# EAGLE design SchematicWeatherStationModule (EAGLE 9.6.2)
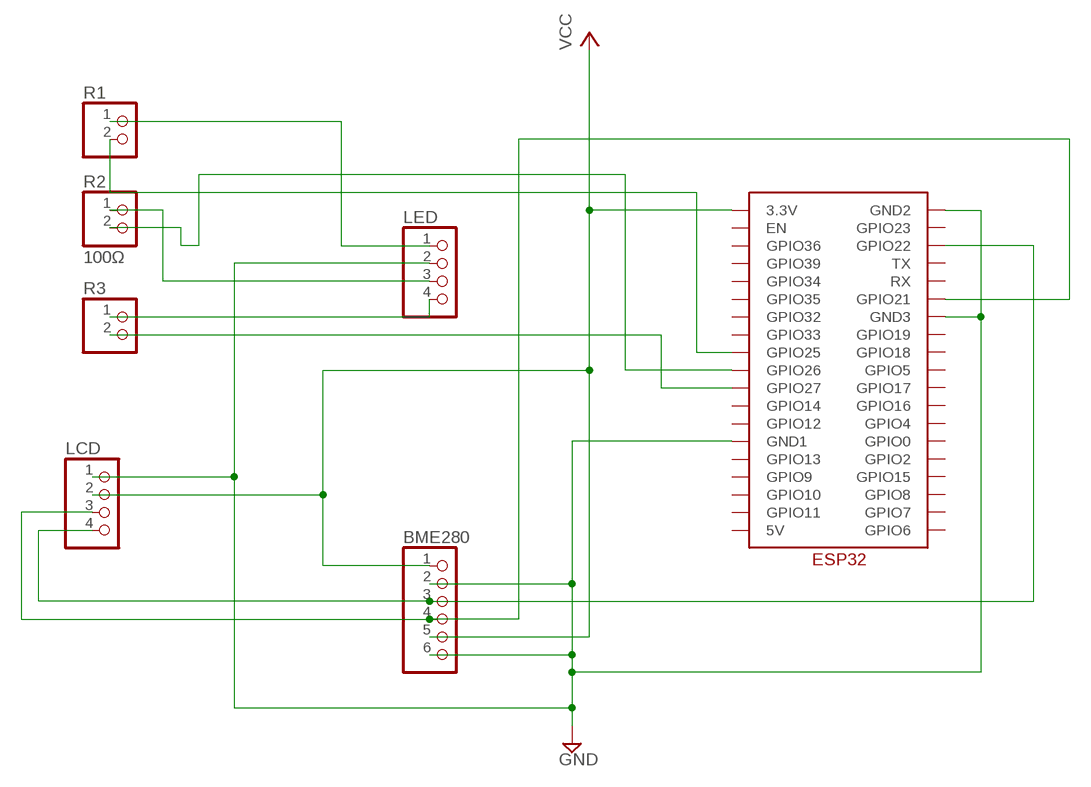
[diagram p0: schematic, sheet 1]

## Parts
BME280  PINHD-1X6/90  [1X06/90]
LCD  PINHD-1X4/90  [1X04/90]
LED  PINHD-1X4  [1X04]
R1  PINHD-1X2  [1X02]
R2  100Ω  PINHD-1X2  [1X02]
R3  PINHD-1X2  [1X02]
U$1  ESP32  [ESP32]

## Nets
GND: BME280.2 BME280.6 LCD.1 LED.2 U$1.GND1 U$1.GND2 U$1.GND3
N$1: LED.1 R1.1
N$2: LED.3 R2.1
N$3: LED.4 R3.1
N$4: R3.2 U$1.GPIO27
N$5: R1.2 U$1.GPIO25
N$6: R2.2 U$1.GPIO26
SCL: BME280.3 LCD.4 U$1.GPIO22
SDA: BME280.4 LCD.3 U$1.GPIO21
VCC: BME280.1 BME280.5 LCD.2 U$1.3.3V
Unconnected: U$1.5V U$1.EN U$1.GPIO0 U$1.GPIO2 U$1.GPIO4 U$1.GPIO5 U$1.GPIO6 U$1.GPIO7 U$1.GPIO8 U$1.GPIO9 U$1.GPIO10 U$1.GPIO11 U$1.GPIO12 U$1.GPIO13 U$1.GPIO14 U$1.GPIO15 U$1.GPIO16 U$1.GPIO17 U$1.GPIO18 U$1.GPIO19 U$1.GPIO23 U$1.GPIO32 U$1.GPIO33 U$1.GPIO34 U$1.GPIO35 U$1.GPIO36 U$1.GPIO39 U$1.RX U$1.TX

## Library data of the parts
BME280 = pinhead:PINHD-1X6: PIN HEADER
LCD LED = pinhead:PINHD-1X4: PIN HEADER
R1-R3 = pinhead:PINHD-1X2: PIN HEADER
U$1 = ESP32 Module:ESP32

## Board
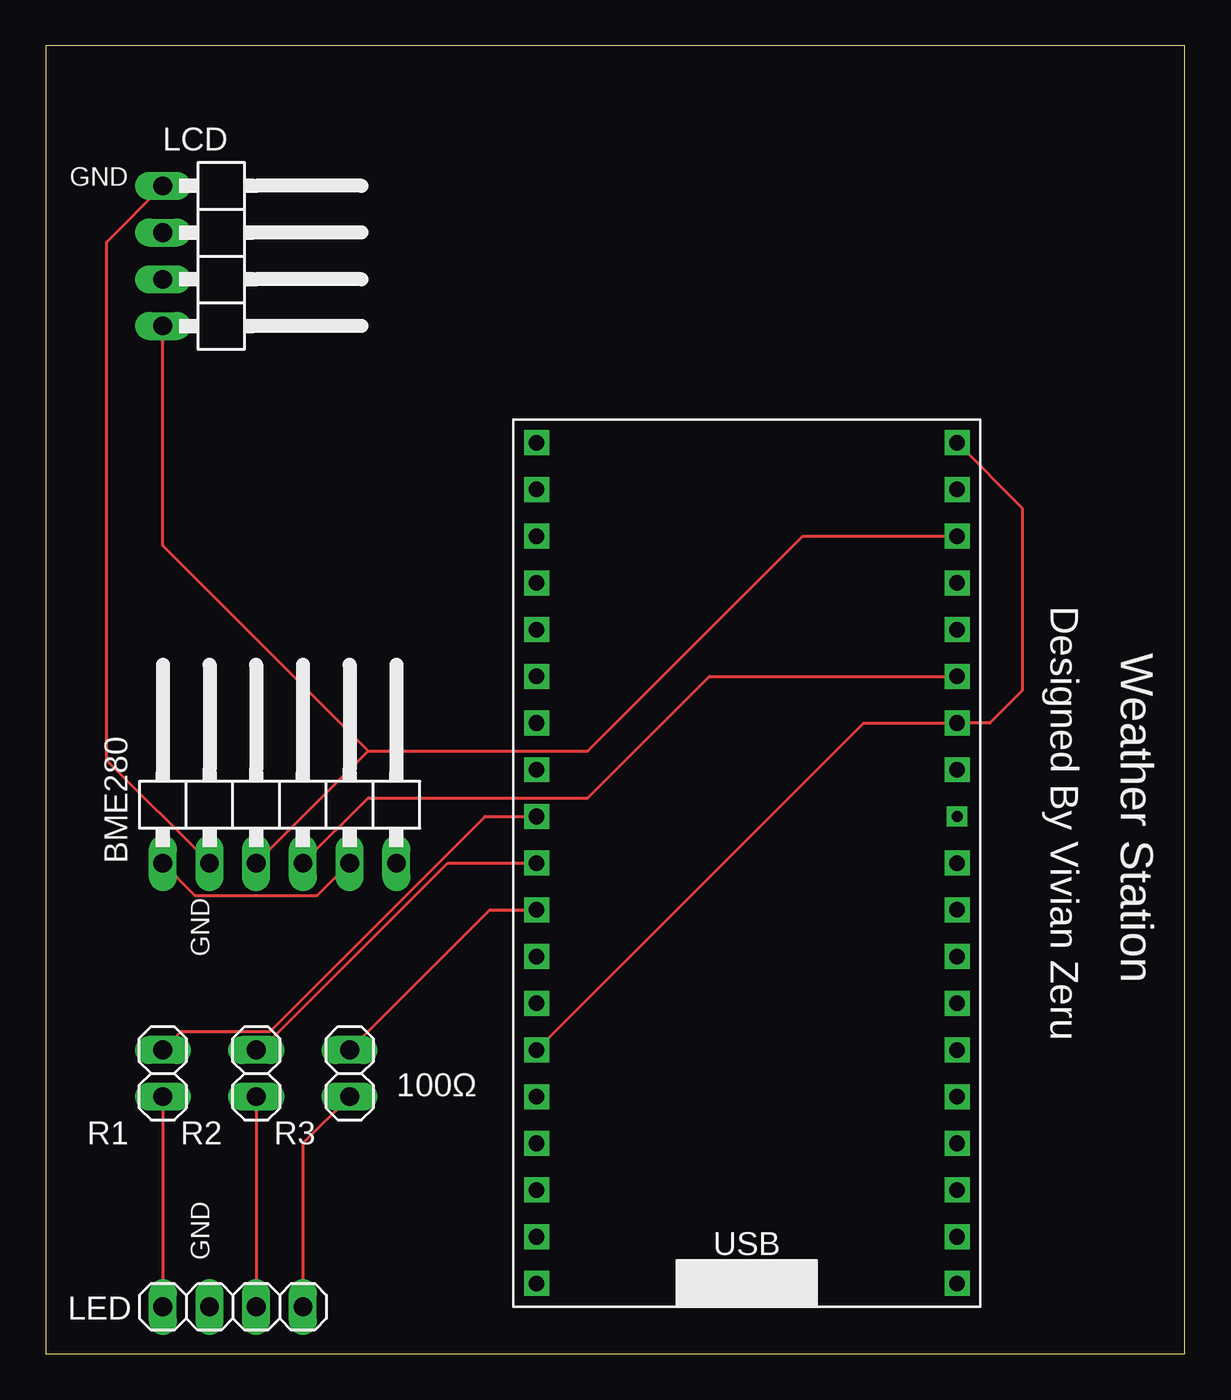
[diagram p1: board, top side]
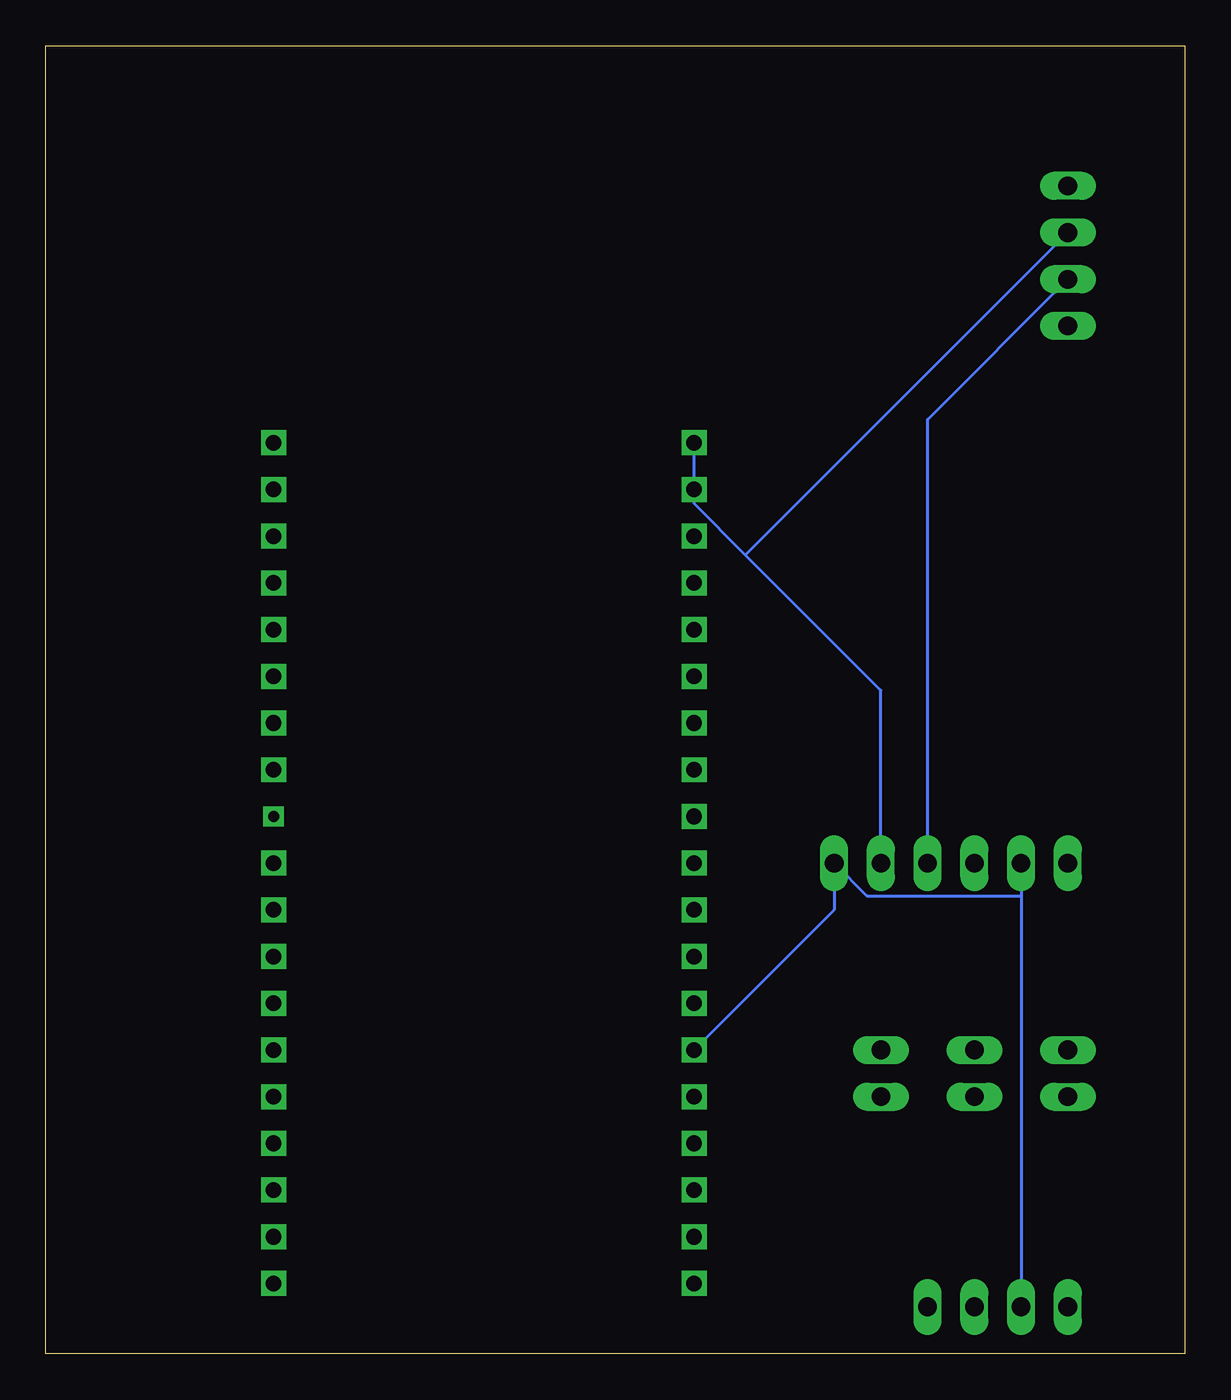
[diagram p2: board, bottom side, seen from below]

Size 61.9 x 71.11 mm. Coordinates in mm from the lower left corner, seen from the top.
Outline: 0,0 61.9,0 61.9,71.11 0,71.11 0,0
Copper layers (1*16): Top 0.035mm / dielectric 1.5mm / Bottom 0.035mm
Design rules "default": minimum track width 6mil, minimum drill 0.35mm, track to track 6mil, track to pad 6mil, pad to pad 6mil, via to via 6mil, smd to smd 6mil, copper to edge 40mil, drill to drill 6mil, minimum pad ring 10mil, minimum via ring 8mil, stop-mask expansion 4mil, vias tented up to drill 0mil, thermal gap 10mil

### Footprints (pad centres in the part's own frame; a part is rotated, then mirrored left to right if it is on the bottom)
1X06/90 = drill 1.016 long: 1 -6.35,-3.81; 2 -3.81,-3.81; 3 -1.27,-3.81; 4 1.27,-3.81; 5 3.81,-3.81; 6 6.35,-3.81
1X04/90 = drill 1.016 long: 1 -3.81,-3.81; 2 -1.27,-3.81; 3 1.27,-3.81; 4 3.81,-3.81
1X04 = drill 1.016 long: 1 -3.81,0; 2 -1.27,0; 3 1.27,0; 4 3.81,0
1X02 = drill 1.016 long: 1 -1.27,0; 2 1.27,0
ESP32 = drill 0.85 square: 3.3V 1.27,46.99; 5V 1.27,1.27; EN 1.27,44.45; GND1 1.27,13.97; GND2 24.13,46.99; GND3 24.13,31.75; GPIO0 24.13,13.97; GPIO2 24.13,11.43; GPIO4 24.13,16.51; GPIO5 24.13,24.13; GPIO6 24.13,1.27; GPIO7 24.13,3.81; GPIO8 24.13,6.35; GPIO9 1.27,8.89; GPIO10 1.27,6.35; GPIO11 1.27,3.81; GPIO12 1.27,16.51; GPIO13 1.27,11.43; GPIO14 1.27,19.05; GPIO15 24.13,8.89; GPIO16 24.13,19.05; GPIO17 24.13,21.59; GPIO19 24.13,29.21; GPIO21 24.13,34.29; GPIO22 24.13,41.91; GPIO23 24.13,44.45; GPIO25 1.27,26.67; GPIO26 1.27,24.13; GPIO27 1.27,21.59; GPIO32 1.27,31.75; GPIO33 1.27,29.21; GPIO34 1.27,36.83; GPIO35 1.27,34.29; GPIO36 1.27,41.91; GPIO39 1.27,39.37; RX 24.13,36.83; TX 24.13,39.37 | drill 0.6 square: GPIO18 24.13,26.67

### Placement (x,y rotation side)
BME280  12.7,30.48 0 top
LCD  10.16,59.69 270 top
LED  10.16,2.54 0 top
R1  6.35,15.24 90 top
R2  11.43,15.24 90 top
R3  16.51,15.24 90 top
U$1  25.4,2.54 0 top

### Tracks (layer width: path | path; a pad name or v marks a point on that pad's centre or on a via)
GND
  Top 0.152: LCD.1 3.3,60.45 3.3,32.26 BME280.2 | U$1.GND2 53.09,45.97 53.09,36.07 51.31,34.29 U$1.GND3 44.45,34.29 U$1.GND1
  Bottom 0.152: BME280.2 8.89,24.89 | 8.89,24.89 LED.2 | U$1.GND1 19.05,24.13 BME280.6 17.27,24.89 8.89,24.89
N$1
  Top 0.152: R1.1 LED.1
N$2
  Top 0.152: R2.1 LED.3
N$3
  Top 0.152: LED.4 13.97,11.43 R3.1
N$4
  Top 0.152: U$1.GPIO27 24.13,24.13 R3.2
N$5
  Top 0.152: U$1.GPIO25 23.88,29.21 12.19,17.53 7.37,17.53 R1.2
N$6
  Top 0.152: U$1.GPIO26 21.84,26.67 11.68,16.51 R2.2
SCL
  Top 0.152: U$1.GPIO22 41.15,44.45 29.46,32.77 17.53,32.77 | BME280.3 17.53,32.77 | LCD.4 6.35,43.94 17.53,32.77
SDA
  Top 0.152: U$1.GPIO21 36.07,36.83 29.46,30.23 17.53,30.23 BME280.4
  Bottom 0.152: LCD.3 13.97,50.8 BME280.4
VCC
  Top 0.152: BME280.1 8.13,24.89 14.73,24.89 BME280.5
  Bottom 0.152: U$1.3.3V 26.67,46.23 23.88,43.43 | 23.88,43.43 16.51,36.07 BME280.5 | 23.88,43.43 LCD.2

### Text on the board
tPlace: GND | Designed By Vivian Zeru | Weather Station | GND | 100Ω | GND